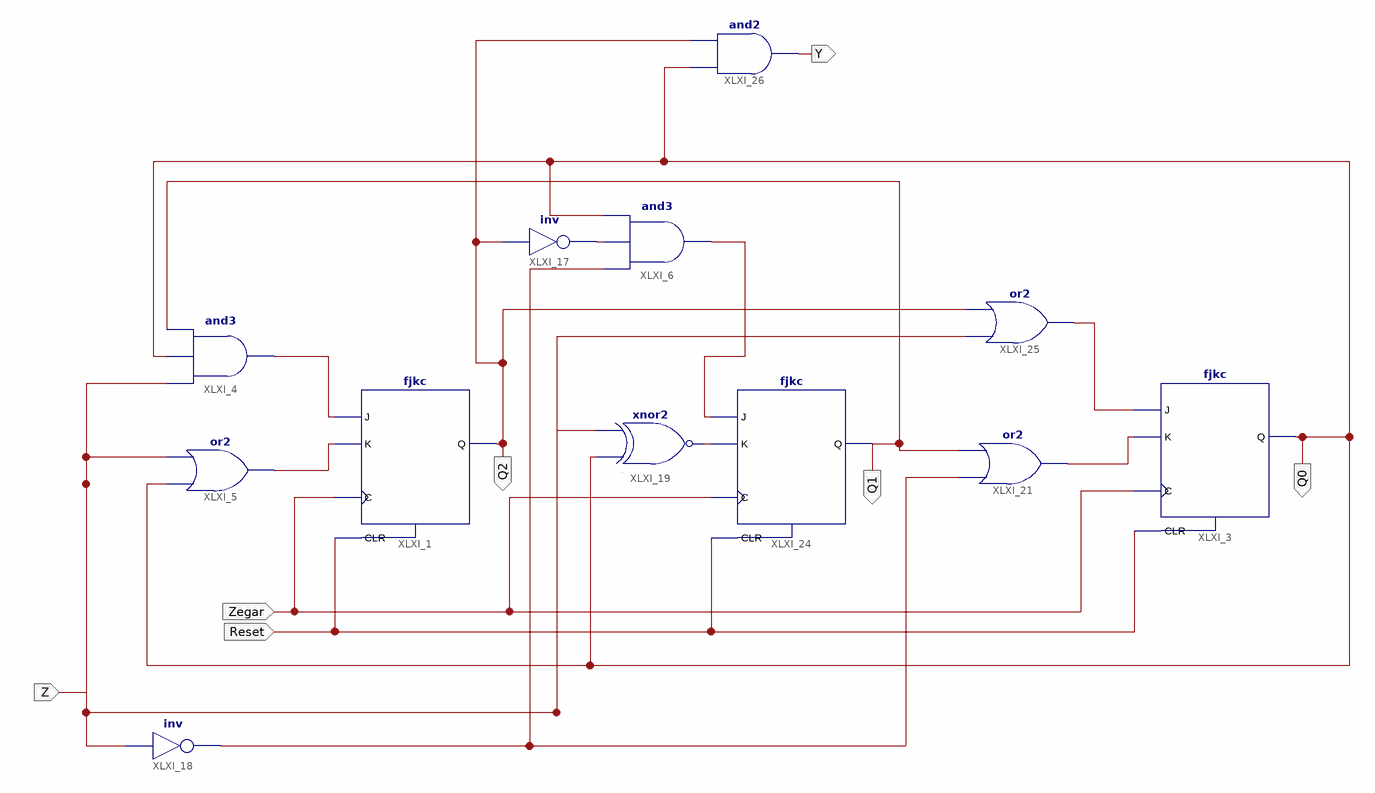
[diagram p0: schematic sheet 1]
// Xilinx ISE schematic zad2.sch (artix7) as structural Verilog: 12 symbols, 7 ports
module zad2 (
  input  Z,
  input  Zegar,
  input  Reset,
  output Q1,
  output Q2,
  output Y,
  output Q0
);

  wire XLXN_2, XLXN_10, XLXN_30, XLXN_42, XLXN_47, XLXN_58, XLXN_64, XLXN_94;

  and XLXI_4 (XLXN_2, Z, Q0, Q1);
  or XLXI_5 (XLXN_10, Q0, Z);
  and XLXI_6 (XLXN_47, XLXN_30, XLXN_58, Q0);
  fjkc XLXI_3 (.C(Zegar), .CLR(Reset), .J(XLXN_94), .K(XLXN_42), .Q(Q0));
  fjkc XLXI_1 (.C(Zegar), .CLR(Reset), .J(XLXN_2), .K(XLXN_10), .Q(Q2));
  not XLXI_17 (XLXN_58, Q2);
  xnor XLXI_19 (XLXN_64, Q0, Z);
  or XLXI_21 (XLXN_42, XLXN_30, Q1);
  not XLXI_18 (XLXN_30, Z);
  fjkc XLXI_24 (.C(Zegar), .CLR(Reset), .J(XLXN_47), .K(XLXN_64), .Q(Q1));
  or XLXI_25 (XLXN_94, Z, Q2);
  and XLXI_26 (Y, Q0, Q2);
endmodule
